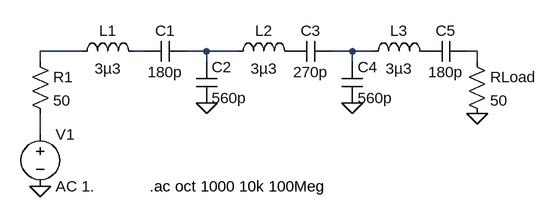
[diagram p0: schematic Draft1.asc]
Draft1.asc, the LTspice schematic file:
Version 4
SHEET 1 880 680
WIRE -144 96 -208 96
WIRE -48 96 -64 96
WIRE 48 96 16 96
WIRE 96 96 48 96
WIRE 272 96 240 96
WIRE 304 96 272 96
WIRE 464 96 448 96
WIRE -208 112 -208 96
WIRE 48 112 48 96
WIRE 272 112 272 96
WIRE 464 112 464 96
WIRE -208 224 -208 192
FLAG 48 176 0
FLAG 272 176 0
FLAG 464 192 0
FLAG -208 304 0
SYMBOL cap 16 80 R90
WINDOW 0 0 32 VBottom 2
WINDOW 3 32 32 VTop 2
SYMATTR InstName C1
SYMATTR Value 180p
SYMATTR SpiceLine ""
SYMBOL cap 32 112 R0
SYMATTR InstName C2
SYMATTR Value 560p
SYMATTR SpiceLine ""
SYMBOL cap 240 80 R90
WINDOW 0 0 32 VBottom 2
WINDOW 3 32 32 VTop 2
SYMATTR InstName C3
SYMATTR Value 270p
SYMATTR SpiceLine ""
SYMBOL cap 256 112 R0
SYMATTR InstName C4
SYMATTR Value 560p
SYMATTR SpiceLine ""
SYMBOL cap 448 80 R90
WINDOW 0 0 32 VBottom 2
WINDOW 3 32 32 VTop 2
SYMATTR InstName C5
SYMATTR Value 180p
SYMATTR SpiceLine ""
SYMBOL ind -160 112 R270
WINDOW 0 32 56 VTop 2
WINDOW 3 5 56 VBottom 2
SYMATTR InstName L1
SYMATTR Value 3µ3
SYMATTR SpiceLine ""
SYMBOL ind 80 112 R270
WINDOW 0 32 56 VTop 2
WINDOW 3 5 56 VBottom 2
SYMATTR InstName L2
SYMATTR Value 3µ3
SYMATTR SpiceLine ""
SYMBOL ind 288 112 R270
WINDOW 0 32 56 VTop 2
WINDOW 3 5 56 VBottom 2
SYMATTR InstName L3
SYMATTR Value 3µ3
SYMATTR SpiceLine ""
SYMBOL res 448 96 R0
SYMATTR InstName RLoad
SYMATTR Value 50
SYMATTR SpiceLine ""
SYMBOL voltage -208 208 R0
WINDOW 123 0 0 Left 2
WINDOW 39 0 0 Left 2
SYMATTR InstName V1
SYMATTR Value AC 1.
SYMATTR Value2 ""
SYMATTR SpiceLine ""
SYMBOL res -224 96 R0
SYMATTR InstName R1
SYMATTR Value 50
SYMATTR SpiceLine ""
TEXT -40 304 Left 2 !.ac oct 1000 10k 100Meg

The netlist it stands for:
* Draft1.asc
C1 N003 N002 180p
C2 N003 0 560p
C3 N004 P001 270p
C4 N004 0 560p
C5 N005 P002 180p
L1 N001 N002 3µ3
L2 N003 P001 3µ3
L3 N004 P002 3µ3
RLoad N005 0 50
V1 N006 0 AC 1.
R1 N001 N006 50
.ac oct 1000 10k 100Meg
.backanno
.end